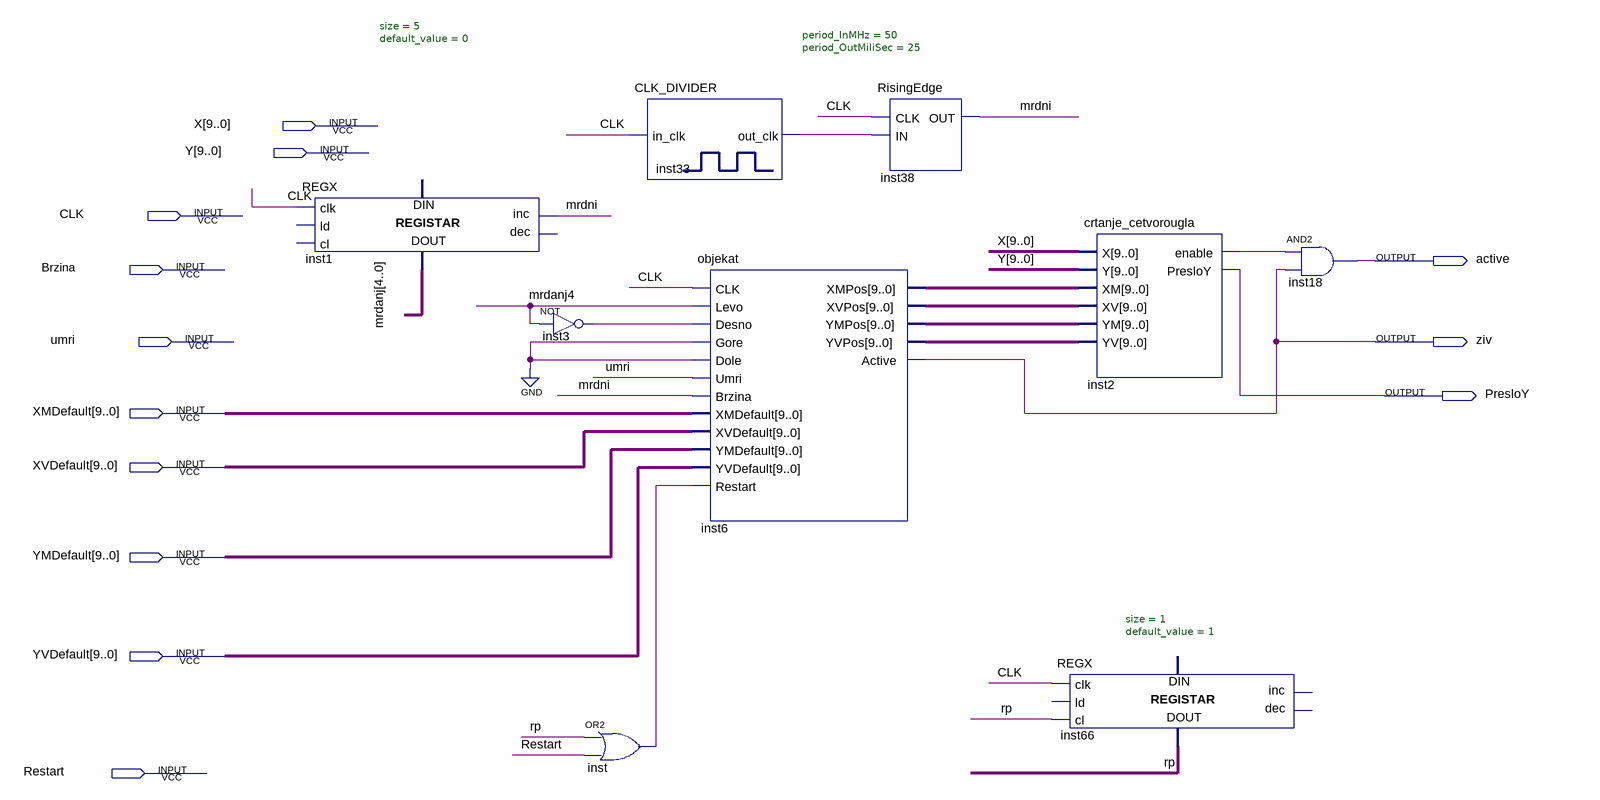
[diagram p0: schematic sheet]
// Quartus schematic pile.bdf as structural Verilog: 9 symbols, 13 pins
module pile (
  input  [9:0] X,
  input  [9:0] Y,
  input  CLK,
  input  Brzina,
  input  umri,
  input  [9:0] XMDefault,
  input  [9:0] XVDefault,
  input  [9:0] YMDefault,
  input  [9:0] YVDefault,
  input  Restart,
  output active,
  output ziv,
  output PresloY
);

  wire inst2_enable, inst3_out, inst33_out_clk, inst_out, mrdni, rp;
  wire [4:0] mrdanj;
  wire [9:0] inst6_xmpos, inst6_xvpos, inst6_ympos, inst6_yvpos;

  REGX #(.size(5), .default_value(0)) inst1 (.clk(CLK), .inc(mrdni), .data_out(mrdanj));  // open: ld, cl, dec, data_in
  not inst3 (inst3_out, mrdanj[4]);
  CLK_DIVIDER #(.period_InMHz(50), .period_OutMiliSec(25)) inst33 (.in_clk(CLK), .out_clk(inst33_out_clk));
  or inst (inst_out, rp, Restart);
  objekat inst6 (
    .CLK(CLK), .Levo(mrdanj[4]), .Desno(inst3_out), .Gore(1'b0), .Dole(1'b0), .Umri(umri), .Brzina(mrdni),
    .XMDefault(XMDefault), .XVDefault(XVDefault), .YMDefault(YMDefault), .YVDefault(YVDefault),
    .Restart(inst_out), .XMPos(inst6_xmpos), .XVPos(inst6_xvpos), .YMPos(inst6_ympos), .YVPos(inst6_yvpos),
    .Active(ziv));
  RisingEdge inst38 (.CLK(CLK), .IN(inst33_out_clk), .OUT(mrdni));
  crtanje_cetvorougla inst2 (
    .X(X), .Y(Y), .XM(inst6_xmpos), .XV(inst6_xvpos), .YM(inst6_ympos), .YV(inst6_yvpos),
    .enable(inst2_enable), .PresloY(PresloY));
  REGX #(.size(1), .default_value(1)) inst66 (.clk(CLK), .cl(rp), .data_out(rp));  // open: ld, inc, dec, data_in
  and inst18 (active, inst2_enable, ziv);
endmodule
